# EAGLE schematic esp-n64 (EAGLE 9.6.2)
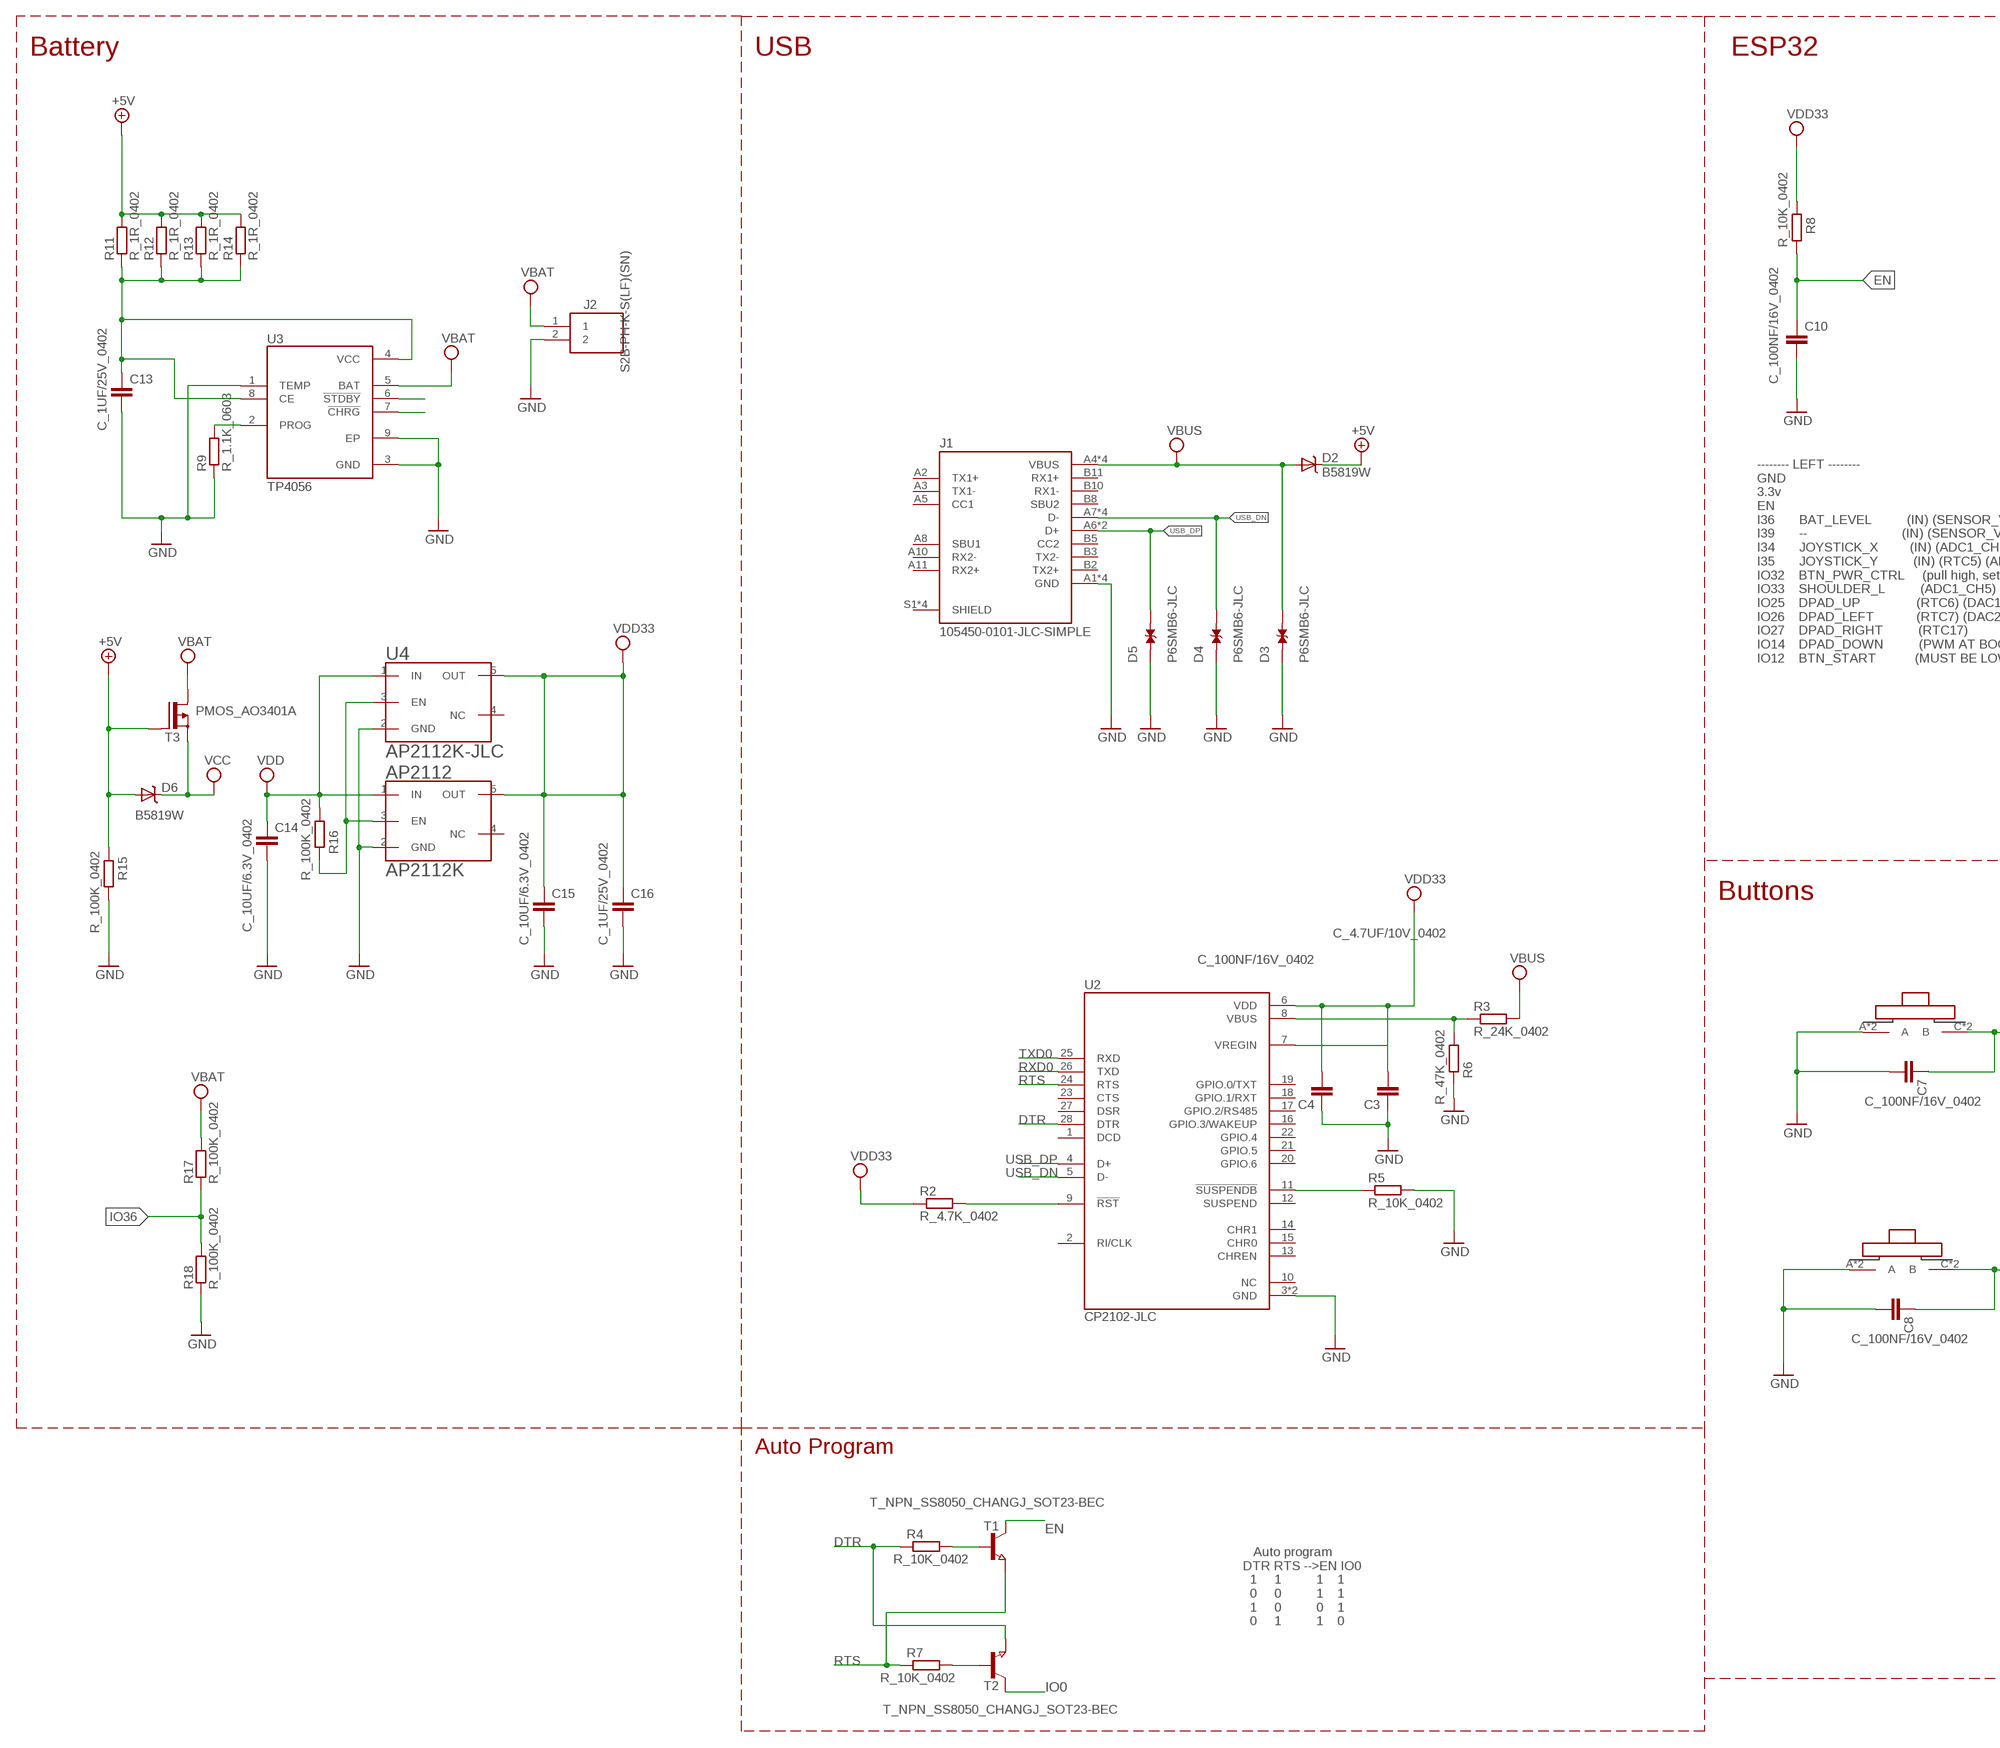
[diagram p0: schematic, sheet 1, part 1 of 2]
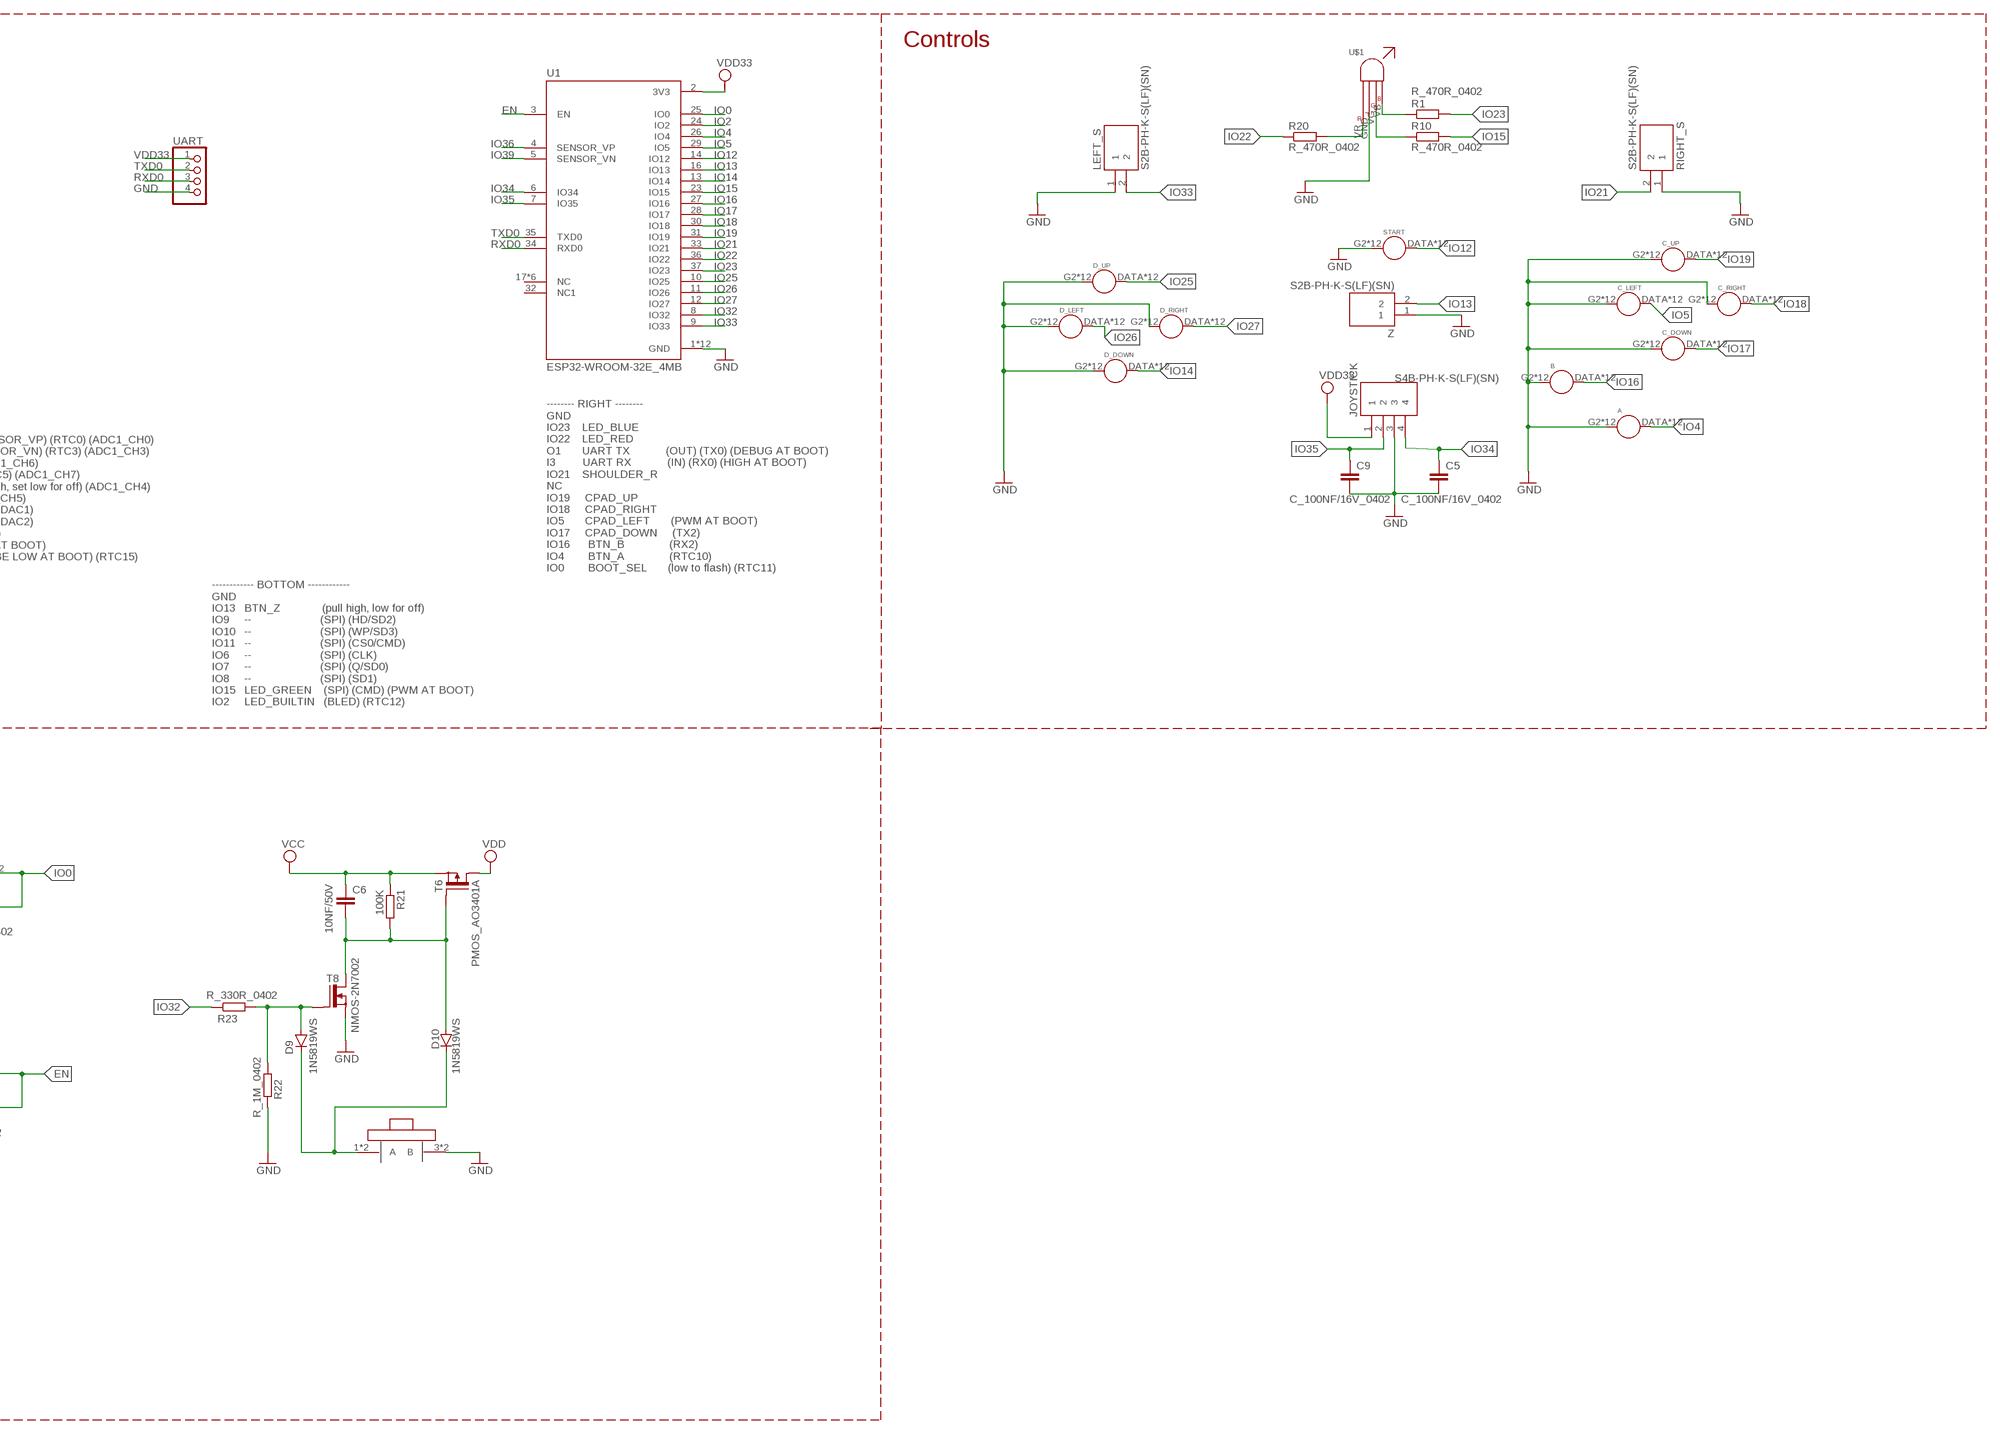
[diagram p1: schematic, sheet 1, part 2 of 2]

## Parts
A  BUTTONPCB-CONDUCTIVE  [BUTTON-PAD]
AP2112  AP2112K  [SOT-23-5]
B  BUTTONPCB-CONDUCTIVE  [BUTTON-PAD]
BOOT  TS1187-SIMPLE  [TS1187]
C3  C_4.7UF/10V_0402  [C0402]
C4  C_100NF/16V_0402  [C0402]
C5  C_100NF/16V_0402  [C0402]
C6  10NF/50V  C_10NF/50V_0402  [C0402]
C7  C_100NF/16V_0402  [C0402]
C8  C_100NF/16V_0402  [C0402]
C9  C_100NF/16V_0402  [C0402]
C10  C_100NF/16V_0402  [C0402]
C13  C_1UF/25V_0402  [C0402]
C14  C_10UF/6.3V_0402  [C0402]
C15  C_10UF/6.3V_0402  [C0402]
C16  C_1UF/25V_0402  [C0402]
C_DOWN  BUTTONPCB-CONDUCTIVE  [BUTTON-PAD]
C_LEFT  BUTTONPCB-CONDUCTIVE  [BUTTON-PAD]
C_RIGHT  BUTTONPCB-CONDUCTIVE  [BUTTON-PAD]
C_UP  BUTTONPCB-CONDUCTIVE  [BUTTON-PAD]
CTRL  FSM14J-SIMPLE  [SW_FSM14J]
D2  B5819W  [SOD-123]
D3  P6SMB6-JLC  [P6SMB6]
D4  P6SMB6-JLC  [P6SMB6]
D5  P6SMB6-JLC  [P6SMB6]
D6  B5819W  [SOD-123]
D9  1N5819WS  D_1N5819WS_GUANGH_SOD323  [SOD323]
D10  1N5819WS  D_1N5819WS_GUANGH_SOD323  [SOD323]
D_DOWN  BUTTONPCB-CONDUCTIVE  [BUTTON-PAD]
D_LEFT  BUTTONPCB-CONDUCTIVE  [BUTTON-PAD]
D_RIGHT  BUTTONPCB-CONDUCTIVE  [BUTTON-PAD]
D_UP  D_UP  BUTTONPCB-CONDUCTIVE  [BUTTON-PAD]
J1  105450-0101-JLC-SIMPLE  [MOLEX_105450-0101-SIMPLE]
J2  S2B-PH-K-S(LF)(SN)  [JST_S2B-PH-K-S(LF)(SN)]
JOYSTICK  S4B-PH-K-S(LF)(SN)  [JST_S4B-PH-K-S(LF)(SN)]
LEFT_S  S2B-PH-K-S(LF)(SN)  [JST_S2B-PH-K-S(LF)(SN)]
R1  R_470R_0402  [R0402]
R2  R_4.7K_0402  [R0402]
R3  R_24K_0402  [R0402]
R4  R_10K_0402  [R0402]
R5  R_10K_0402  [R0402]
R6  R_47K_0402  [R0402]
R7  R_10K_0402  [R0402]
R8  R_10K_0402  [R0402]
R9  R_1.1K_0603  [R0603]
R10  R_470R_0402  [R0402]
R11  R_1R_0402  [R0402]
R12  R_1R_0402  [R0402]
R13  R_1R_0402  [R0402]
R14  R_1R_0402  [R0402]
R15  R_100K_0402  [R0402]
R16  R_100K_0402  [R0402]
R17  R_100K_0402  [R0402]
R18  R_100K_0402  [R0402]
R20  R_470R_0402  [R0402]
R21  100K  R_100K_0402  [R0402]
R22  R_1M_0402  [R0402]
R23  R_330R_0402  [R0402]
RESET  TS1187-SIMPLE  [TS1187]
RIGHT_S  S2B-PH-K-S(LF)(SN)  [JST_S2B-PH-K-S(LF)(SN)]
START  BUTTONPCB-CONDUCTIVE  [BUTTON-PAD]
T1  T_NPN_SS8050_CHANGJ_SOT23-BEC  [SOT23]
T2  T_NPN_SS8050_CHANGJ_SOT23-BEC  [SOT23]
T3  PMOS_AO3401A  T_P-MOSFET_AO3401A_ALPHA_SOT23-GSD  [SOT23]
T6  PMOS_AO3401A  T_P-MOSFET_AO3401A_ALPHA_SOT23-GSD  [SOT23]
T8  NMOS-2N7002  T_N-MOSFET_2N7002_CHANGJ_SOT23-GSD  [SOT23]
U1  ESP32-WROOM-32E_4MB  [ESP32-WROOM-32E]
U2  CP2102-JLC  [QFN50P500X500X80-29N]
U3  TP4056  [SOP127P600X175-9N]
U4  AP2112K-JLC  [SOT-23-5]
U$1  RGB-LED  [1X04-LED-RGB]
UART  PINHD-1X4  [1X04]
Z  S2B-PH-K-S(LF)(SN)  [JST_S2B-PH-K-S(LF)(SN)]

## Nets
+5V: D2.C D6.A R11.2 R12.2 R13.2 R14.2 R15.2 T3.1(G)
DTR: R4.1 T2.2(E) U2.28(DTR)
EN: C8.1 C10.1 R8.1 RESET.C(B) RESET.D(B) T1.3(C) U1.3(EN)
GND: A.G2(GND) A.G3(GND) A.G4(GND) A.G5(GND) A.G6(GND) A.G7(GND) A.G8(GND) A.G9(GND) A.G10(GND) A.G11(GND) A.G12(GND) A.GND AP2112.2(GND) B.G2(GND) B.G3(GND) B.G4(GND) B.G5(GND) B.G6(GND) B.G7(GND) B.G8(GND) B.G9(GND) B.G10(GND) B.G11(GND) B.G12(GND) B.GND BOOT.A BOOT.B(A) C3.1 C4.1 C5.2 C7.2 C8.2 C9.2 C10.2 C13.2 C14.2 C15.2 C16.2 C_DOWN.G2(GND) C_DOWN.G3(GND) C_DOWN.G4(GND) C_DOWN.G5(GND) C_DOWN.G6(GND) C_DOWN.G7(GND) C_DOWN.G8(GND) C_DOWN.G9(GND) C_DOWN.G10(GND) C_DOWN.G11(GND) C_DOWN.G12(GND) C_DOWN.GND C_LEFT.G2(GND) C_LEFT.G3(GND) C_LEFT.G4(GND) C_LEFT.G5(GND) C_LEFT.G6(GND) C_LEFT.G7(GND) C_LEFT.G8(GND) C_LEFT.G9(GND) C_LEFT.G10(GND) C_LEFT.G11(GND) C_LEFT.G12(GND) C_LEFT.GND C_RIGHT.G2(GND) C_RIGHT.G3(GND) C_RIGHT.G4(GND) C_RIGHT.G5(GND) C_RIGHT.G6(GND) C_RIGHT.G7(GND) C_RIGHT.G8(GND) C_RIGHT.G9(GND) C_RIGHT.G10(GND) C_RIGHT.G11(GND) C_RIGHT.G12(GND) C_RIGHT.GND C_UP.G2(GND) C_UP.G3(GND) C_UP.G4(GND) C_UP.G5(GND) C_UP.G6(GND) C_UP.G7(GND) C_UP.G8(GND) C_UP.G9(GND) C_UP.G10(GND) C_UP.G11(GND) C_UP.G12(GND) C_UP.GND CTRL.3(B) CTRL.4(B) D3.1 D4.1 D5.1 D_DOWN.G2(GND) D_DOWN.G3(GND) D_DOWN.G4(GND) D_DOWN.G5(GND) D_DOWN.G6(GND) D_DOWN.G7(GND) D_DOWN.G8(GND) D_DOWN.G9(GND) D_DOWN.G10(GND) D_DOWN.G11(GND) D_DOWN.G12(GND) D_DOWN.GND D_LEFT.G2(GND) D_LEFT.G3(GND) D_LEFT.G4(GND) D_LEFT.G5(GND) D_LEFT.G6(GND) D_LEFT.G7(GND) D_LEFT.G8(GND) D_LEFT.G9(GND) D_LEFT.G10(GND) D_LEFT.G11(GND) D_LEFT.G12(GND) D_LEFT.GND D_RIGHT.G2(GND) D_RIGHT.G3(GND) D_RIGHT.G4(GND) D_RIGHT.G5(GND) D_RIGHT.G6(GND) D_RIGHT.G7(GND) D_RIGHT.G8(GND) D_RIGHT.G9(GND) D_RIGHT.G10(GND) D_RIGHT.G11(GND) D_RIGHT.G12(GND) D_RIGHT.GND D_UP.G2(GND) D_UP.G3(GND) D_UP.G4(GND) D_UP.G5(GND) D_UP.G6(GND) D_UP.G7(GND) D_UP.G8(GND) D_UP.G9(GND) D_UP.G10(GND) D_UP.G11(GND) D_UP.G12(GND) D_UP.GND J1.A1(GND) J1.A12(GND) J1.B1(GND) J1.B12(GND) J2.2 JOYSTICK.3 LEFT_S.1 R5.2 R6.1 R9.1 R15.1 R18.1 R22.2 RESET.A RESET.B(A) RIGHT_S.1 START.G2(GND) START.G3(GND) START.G4(GND) START.G5(GND) START.G6(GND) START.G7(GND) START.G8(GND) START.G9(GND) START.G10(GND) START.G11(GND) START.G12(GND) START.GND T8.2(S) U1.1(GND) U1.15(GND) U1.38(GND) U1.39_1(GND) U1.39_2(GND) U1.39_3(GND) U1.39_4(GND) U1.39_5(GND) U1.39_6(GND) U1.39_7(GND) U1.39_8(GND) U1.39_9(GND) U2.3(GND) U2.29(GND) U3.1(TEMP) U3.3(GND) U3.9(EP) U4.2(GND) U$1.GND UART.4 Z.1
IO0: BOOT.C(B) BOOT.D(B) C7.1 T2.3(C) U1.25(IO0)
IO2: U1.24(IO2)
IO4: A.DATA2(D) A.DATA3(D) A.DATA4(D) A.DATA5(D) A.DATA6(D) A.DATA7(D) A.DATA8(D) A.DATA9(D) A.DATA10(D) A.DATA11(D) A.DATA12(D) A.DATA(D) U1.26(IO4)
IO5: C_LEFT.DATA2(D) C_LEFT.DATA3(D) C_LEFT.DATA4(D) C_LEFT.DATA5(D) C_LEFT.DATA6(D) C_LEFT.DATA7(D) C_LEFT.DATA8(D) C_LEFT.DATA9(D) C_LEFT.DATA10(D) C_LEFT.DATA11(D) C_LEFT.DATA12(D) C_LEFT.DATA(D) U1.29(IO5)
IO12: START.DATA2(D) START.DATA3(D) START.DATA4(D) START.DATA5(D) START.DATA6(D) START.DATA7(D) START.DATA8(D) START.DATA9(D) START.DATA10(D) START.DATA11(D) START.DATA12(D) START.DATA(D) U1.14(IO12)
IO13: U1.16(IO13) Z.2
IO14: D_DOWN.DATA2(D) D_DOWN.DATA3(D) D_DOWN.DATA4(D) D_DOWN.DATA5(D) D_DOWN.DATA6(D) D_DOWN.DATA7(D) D_DOWN.DATA8(D) D_DOWN.DATA9(D) D_DOWN.DATA10(D) D_DOWN.DATA11(D) D_DOWN.DATA12(D) D_DOWN.DATA(D) U1.13(IO14)
IO15: R10.2 U1.23(IO15)
IO16: B.DATA2(D) B.DATA3(D) B.DATA4(D) B.DATA5(D) B.DATA6(D) B.DATA7(D) B.DATA8(D) B.DATA9(D) B.DATA10(D) B.DATA11(D) B.DATA12(D) B.DATA(D) U1.27(IO16)
IO17: C_DOWN.DATA2(D) C_DOWN.DATA3(D) C_DOWN.DATA4(D) C_DOWN.DATA5(D) C_DOWN.DATA6(D) C_DOWN.DATA7(D) C_DOWN.DATA8(D) C_DOWN.DATA9(D) C_DOWN.DATA10(D) C_DOWN.DATA11(D) C_DOWN.DATA12(D) C_DOWN.DATA(D) U1.28(IO17)
IO18: C_RIGHT.DATA2(D) C_RIGHT.DATA3(D) C_RIGHT.DATA4(D) C_RIGHT.DATA5(D) C_RIGHT.DATA6(D) C_RIGHT.DATA7(D) C_RIGHT.DATA8(D) C_RIGHT.DATA9(D) C_RIGHT.DATA10(D) C_RIGHT.DATA11(D) C_RIGHT.DATA12(D) C_RIGHT.DATA(D) U1.30(IO18)
IO19: C_UP.DATA2(D) C_UP.DATA3(D) C_UP.DATA4(D) C_UP.DATA5(D) C_UP.DATA6(D) C_UP.DATA7(D) C_UP.DATA8(D) C_UP.DATA9(D) C_UP.DATA10(D) C_UP.DATA11(D) C_UP.DATA12(D) C_UP.DATA(D) U1.31(IO19)
IO21: RIGHT_S.2 U1.33(IO21)
IO22: R20.1 U1.36(IO22)
IO23: R1.2 U1.37(IO23)
IO25: D_UP.DATA2(D) D_UP.DATA3(D) D_UP.DATA4(D) D_UP.DATA5(D) D_UP.DATA6(D) D_UP.DATA7(D) D_UP.DATA8(D) D_UP.DATA9(D) D_UP.DATA10(D) D_UP.DATA11(D) D_UP.DATA12(D) D_UP.DATA(D) U1.10(IO25)
IO26: D_LEFT.DATA2(D) D_LEFT.DATA3(D) D_LEFT.DATA4(D) D_LEFT.DATA5(D) D_LEFT.DATA6(D) D_LEFT.DATA7(D) D_LEFT.DATA8(D) D_LEFT.DATA9(D) D_LEFT.DATA10(D) D_LEFT.DATA11(D) D_LEFT.DATA12(D) D_LEFT.DATA(D) U1.11(IO26)
IO27: D_RIGHT.DATA2(D) D_RIGHT.DATA3(D) D_RIGHT.DATA4(D) D_RIGHT.DATA5(D) D_RIGHT.DATA6(D) D_RIGHT.DATA7(D) D_RIGHT.DATA8(D) D_RIGHT.DATA9(D) D_RIGHT.DATA10(D) D_RIGHT.DATA11(D) D_RIGHT.DATA12(D) D_RIGHT.DATA(D) U1.12(IO27)
IO32: R23.1 U1.8(IO32)
IO33: LEFT_S.2 U1.9(IO33)
IO34: C5.1 JOYSTICK.4 U1.6(IO34)
IO35: C9.1 JOYSTICK.2 U1.7(IO35)
IO36: R17.1 R18.2 U1.4(SENSOR_VP)
IO39: U1.5(SENSOR_VN)
N$1: R20.2 U$1.VR
N$2: AP2112.3(EN) R16.1 U4.3(EN)
N$4: D9.A R22.1 R23.2 T8.1(G)
N$5: R10.1 U$1.VG
N$6: R4.2 T1.1(B)
N$7: R7.2 T2.1(B)
N$8: C13.1 R11.1 R12.1 R13.1 R14.1 U3.4(VCC) U3.8(CE)
N$9: R1.1 U$1.VB
N$11: R2.2 U2.9(!RST)
N$12: U3.6(!STDBY)
N$14: R3.1 R6.2 U2.8(VBUS)
N$15: C6.2 D10.A R21.2 T6.1(G) T8.3(D)
N$16: U3.7(!CHRG)
N$17: R9.2 U3.2(PROG)
N$23: R5.1 U2.11(!SUSPENDB)
N$28: CTRL.1(A) CTRL.2(A) D9.C D10.C
RTS: R7.1 T1.2(E) U2.24(RTS)
RXD0: U1.34(RXD0) U2.26(TXD) UART.3
TXD0: U1.35(TXD0) U2.25(RXD) UART.2
USB_DN: D4.2 J1.A7(D-) J1.B7(D-) J1.P$1(D-) J1.P$2(D-) U2.5(D-)
USB_DP: D5.2 J1.A6(D+) J1.B6(D+) U2.4(D+)
VBAT: J2.1 R17.2 T3.3(D) U3.5(BAT)
VBUS: D2.A D3.2 J1.A4(VBUS) J1.A9(VBUS) J1.B4(VBUS) J1.B9(VBUS) R3.2
VCC: C6.1 D6.C R21.1 T3.2(S) T6.2(S)
VDD: AP2112.1(IN) C14.1 R16.2 T6.3(D) U4.1(IN)
VDD33: AP2112.5(OUT) C3.2 C4.2 C15.1 C16.1 JOYSTICK.1 R2.1 R8.2 U1.2(3V3) U2.6(VDD) U2.7(VREGIN) U4.5(OUT) UART.1
Unconnected: AP2112.4(NC) J1.A2(TX1+) J1.A3(TX1-) J1.A5(CC1) J1.A8(SBU1) J1.A10(RX2-) J1.A11(RX2+) J1.B2(TX2+) J1.B3(TX2-) J1.B5(CC2) J1.B8(SBU2) J1.B10(RX1-) J1.B11(RX1+) J1.S1(SHIELD) J1.S2(SHIELD) J1.S3(SHIELD) J1.S4(SHIELD) U1.17(NC) U1.18(NC) U1.19(NC) U1.20(NC) U1.21(NC) U1.22(NC) U1.32(NC1) U2.1(DCD) U2.2(RI/CLK) U2.10(NC) U2.12(SUSPEND) U2.13(CHREN) U2.14(CHR1) U2.15(CHR0) U2.16(GPIO.3/WAKEUP) U2.17(GPIO.2/RS485) U2.18(GPIO.1/RXT) U2.19(GPIO.0/TXT) U2.20(GPIO.6) U2.21(GPIO.5) U2.22(GPIO.4) U2.23(CTS) U2.27(DSR) U4.4(NC)

## Notes on the sheet
- Battery | USB | ESP32 | Controls
- -------- LEFT --------
  GND
  3.3v
  EN
  I36       BAT_LEVEL          (IN) (SENSOR_VP) (RTC0) (ADC1_CH0)
  I39       --                           (IN) (SENSOR_VN) (RTC3) (ADC1_CH3)
  I34       JOYSTICK_X         (IN) (ADC1_CH6)
  I35       JOYSTICK_Y          (IN) (RTC5) (ADC1_CH7)
  IO32    BTN_PWR_CTRL     (pull high, set low for off) (ADC1_CH4)
  IO33    SHOULDER_L          (ADC1_CH5)
  IO25    DPAD_UP                (RTC6) (DAC1) 
  IO26    DPAD_LEFT            (RTC7) (DAC2) 
  IO27    DPAD_RIGHT          (RTC17)
  IO14    DPAD_DOWN          (PWM AT BOOT)
  IO12    BTN_START           (MUST BE LOW AT BOOT) (RTC15)
- -------- RIGHT --------
  GND
  IO23    LED_BLUE
  IO22    LED_RED
  O1       UART TX            (OUT) (TX0) (DEBUG AT BOOT)
  I3         UART RX            (IN) (RX0) (HIGH AT BOOT)
  IO21    SHOULDER_R
  NC
  IO19     CPAD_UP
  IO18     CPAD_RIGHT
  IO5       CPAD_LEFT       (PWM AT BOOT)
  IO17     CPAD_DOWN     (TX2)
  IO16      BTN_B               (RX2)
  IO4        BTN_A               (RTC10)
  IO0        BOOT_SEL       (low to flash) (RTC11)
- ------------ BOTTOM ------------
  GND
  IO13   BTN_Z              (pull high, low for off)
  IO9     --                       (SPI) (HD/SD2)
  IO10   --                       (SPI) (WP/SD3)
  IO11   --                       (SPI) (CS0/CMD)
  IO6     --                       (SPI) (CLK)
  IO7     --                       (SPI) (Q/SD0)
  IO8     --                       (SPI) (SD1)
  IO15   LED_GREEN    (SPI) (CMD) (PWM AT BOOT)
  IO2     LED_BUILTIN   (BLED) (RTC12)
- Buttons
- Auto Program
- Auto program 
  DTR RTS -->EN IO0 
    1     1          1    1 
    0     0          1    1 
    1     0          0    1 
    0     1          1    0

## Library data of the parts
A B C_DOWN C_LEFT C_RIGHT C_UP D_DOWN D_LEFT D_RIGHT D_UP START = controller-inputs:BUTTON
AP2112 = AP2112:AP2112K: Sot223/Pkg 1-Amp 5-Volt Low Drop Out Voltage Regulatator Check availability <https://pricing.snapeda.com/parts/AMS1117/Advanced%20Monolithic%20Systems/view-part?ref=eda>
BOOT RESET = tactileswitch-ts1187:TS1187-SIMPLE; LCSC_PART: C318884
C3 = JLC PCB Basic Parts_loc:C_: Capacitor General purpose SMD Capacitor; LCSC_DATASHEET: https://datasheet.lcsc.com/lcsc/1810191211_Samsung-Electro-Mechanics-CL05A475MP5NRNC_C23733.pdf; LCSC_PART: C23733; LCSC_ROTATION_CCW: 0; LCSC_STOCK: 424928; PROPERTIES: 10V 4.7uF X5R ±20% 0402 ROHS
C4 C5 C7-C10 = JLC PCB Basic Parts_loc:C_: Capacitor General purpose SMD Capacitor; LCSC_DATASHEET: https://datasheet.lcsc.com/lcsc/1810191219_Samsung-Electro-Mechanics-CL05B104KO5NNNC_C1525.pdf; LCSC_PART: C1525; LCSC_ROTATION_CCW: 0; LCSC_STOCK: 7852677; PROPERTIES: 16V 100nF X7R ±10% 0402 ROHS
C6 = JLC PCB Basic Parts_loc:C_: Capacitor General purpose SMD Capacitor; LCSC_DATASHEET: https://datasheet.lcsc.com/lcsc/1810191223_Samsung-Electro-Mechanics-CL05B103KB5NNNC_C15195.pdf; LCSC_PART: C15195; LCSC_ROTATION_CCW: 0; LCSC_STOCK: 7659158; PROPERTIES: 50V 10nF X7R ±10% 0402 ROHS
C13 C16 = JLC PCB Basic Parts_loc:C_: Capacitor General purpose SMD Capacitor; LCSC_DATASHEET: https://datasheet.lcsc.com/lcsc/1811091611_Samsung-Electro-Mechanics-CL05A105KA5NQNC_C52923.pdf; LCSC_PART: C52923; LCSC_ROTATION_CCW: 0; LCSC_STOCK: 6404174; PROPERTIES: 25V 1uF X5R ±10% 0402 ROHS
C14 C15 = JLC PCB Basic Parts_loc:C_: Capacitor General purpose SMD Capacitor; LCSC_DATASHEET: https://datasheet.lcsc.com/lcsc/1810191215_Samsung-Electro-Mechanics-CL05A106MQ5NUNC_C15525.pdf; LCSC_PART: C15525; LCSC_ROTATION_CCW: 0; LCSC_STOCK: 1727946; PROPERTIES: 6.3V 10uF X5R ±20% 0402 ROHS
CTRL = tactileswitch-FSM14J:FSM14J-SIMPLE
D2 D6 = B5819W:B5819W: Diode. LCSC C8598 Check availability <https://pricing.snapeda.com/parts/B5819W/MDD/view-part?ref=eda>; AVAILABILITY: In Stock; DESCRIPTION: Diode Schottky 40 V 1.5A Surface Mount SOD-123FL; LCSC_PART: C8598; MF: MDD; MP: B5819W; PACKAGE: None; PRICE: None; PURCHASE-URL: https://pricing.snapeda.com/search/part/B5819W/?ref=eda
D3-D5 = 5v-bidir-protection-P6SMB6:P6SMB6-JLC: Check availability <https://pricing.snapeda.com/parts/LESD5D5.0CT1G/Leshan%20Radio%20Co./view-part?ref=eda>; AVAILABILITY: Not in stock; DESCRIPTION: Transient Voltage Suppressors for ESD Protection; LCSC_PART: C78395; MF: Brightking Elec (TAIWAN); MP: P6SMB6.8CA; PACKAGE: SMB-DO-214AA-0; PRICE: 0.0509
D9 D10 = JLC PCB Basic Parts_loc:D_: Diode; LCSC_DATASHEET: https://datasheet.lcsc.com/lcsc/2204281430_Guangdong-Hottech-1N5819WS_C191023.pdf; LCSC_PART: C191023; PROPERTIES: 40V 600mV@1A 1A SOD-323 Schottky Barrier Diodes (SBD) ROHS
J1 = usbc-molex-105450-0101:105450-0101-JLC-SIMPLE: Check availability <https://pricing.snapeda.com/parts/1054500101/Molex/view-part?ref=eda>; AVAILABILITY: In Stock; DESCRIPTION: USB-C (USB TYPE-C) USB 3.2 Gen 2 (USB 3.1 Gen 2, Superspeed + (USB 3.1)) Receptacle Connector 24 Position Surface Mount, Right Angle; Through Hole; LCSC_PART: C134092; MF: Molex; MP: 1054500101; PACKAGE: None; PRICE: None; PURCHASE-URL: https://pricing.snapeda.com/search/part/1054500101/?ref=eda
J2 LEFT_S RIGHT_S Z = jst-2pin-90:S2B-PH-K-S(LF)(SN): PH Series 2 Position 2.0 mm Through Hole Side Entry Shrouded Header Check availability <https://pricing.snapeda.com/parts/S2B-PH-K-S%28LF%29%28SN%29/JST%20Sales%20America%20Inc./view-part?ref=eda>; AVAILABILITY: In Stock; DESCRIPTION: Connector Header Through Hole, Right Angle 2 position; MF: JST Sales America Inc.; MP: S2B-PH-K-S(LF)(SN); PACKAGE: None; PRICE: None; PURCHASE-URL: https://pricing.snapeda.com/search/part/S2B-PH-K-S(LF)(SN)/?ref=eda
JOYSTICK = jst-4pin-90:S4B-PH-K-S(LF)(SN): PH Series 4 Position 2 mm Pitch Through Hole Side Entry Shrouded Header Check availability <https://pricing.snapeda.com/parts/S4B-PH-K-S%28LF%29%28SN%29/JST%20Sales/view-part?ref=eda>; AVAILABILITY: In Stock; DESCRIPTION: Connector Header Through Hole, Right Angle 4 position 0.079 (2.00mm); MF: JST Sales; MP: S4B-PH-K-S(LF)(SN); PACKAGE: None; PRICE: None; PURCHASE-URL: https://pricing.snapeda.com/search/part/S4B-PH-K-S(LF)(SN)/?ref=eda
R1 R10 R20 = JLC PCB Basic Parts_loc:R_: Resistor General purpose SMD Resistor; LCSC_DATASHEET: https://datasheet.lcsc.com/lcsc/2110252230_UNI-ROYAL-Uniroyal-Elec-0402WGF4700TCE_C25117.pdf; LCSC_PART: C25117; LCSC_ROTATION_CCW: 0; LCSC_STOCK: 83930; PROPERTIES: ±1% 1/16W Thick Film Resistors 50V ±100ppm -55°C~+155°C 470Ohm 0402 ROHS
R2 = JLC PCB Basic Parts_loc:R_: Resistor General purpose SMD Resistor; LCSC_DATASHEET: https://datasheet.lcsc.com/lcsc/2110260030_UNI-ROYAL-Uniroyal-Elec-0402WGF4701TCE_C25900.pdf; LCSC_PART: C25900; LCSC_ROTATION_CCW: 0; LCSC_STOCK: 2784412; PROPERTIES: ±1% 1/16W Thick Film Resistors 50V ±100ppm -55°C~+155°C 4.7kOhm 0402 ROHS
R3 = JLC PCB Basic Parts_loc:R_: Resistor General purpose SMD Resistor; LCSC_DATASHEET: https://datasheet.lcsc.com/lcsc/2110260030_UNI-ROYAL-Uniroyal-Elec-0402WGF2402TCE_C25769.pdf; LCSC_PART: C25769; LCSC_ROTATION_CCW: 0; LCSC_STOCK: 100393; PROPERTIES: ±1% 1/16W Thick Film Resistors 50V ±100ppm -55°C~+155°C 24kOhm 0402 ROHS
R4 R5 R7 R8 = JLC PCB Basic Parts_loc:R_: Resistor General purpose SMD Resistor; LCSC_DATASHEET: https://datasheet.lcsc.com/lcsc/2110260030_UNI-ROYAL-Uniroyal-Elec-0402WGF1002TCE_C25744.pdf; LCSC_PART: C25744; LCSC_ROTATION_CCW: 0; LCSC_STOCK: 11564817; PROPERTIES: ±1% 1/16W Thick Film Resistors 50V ±100ppm -55°C~+155°C 10kOhm 0402 ROHS
R6 = JLC PCB Basic Parts_loc:R_: Resistor General purpose SMD Resistor; LCSC_DATASHEET: https://datasheet.lcsc.com/lcsc/2110260030_UNI-ROYAL-Uniroyal-Elec-0402WGF4702TCE_C25792.pdf; LCSC_PART: C25792; LCSC_ROTATION_CCW: 0; LCSC_STOCK: 1322764; PROPERTIES: ±1% 1/16W Thick Film Resistors 50V ±100ppm -55°C~+155°C 47kOhm 0402 ROHS
R9 = JLC PCB Basic Parts_loc:R_: Resistor General purpose SMD Resistor; LCSC_DATASHEET: https://datasheet.lcsc.com/lcsc/2110252030_UNI-ROYAL-Uniroyal-Elec-0603WAF1101T5E_C22764.pdf; LCSC_PART: C22764; LCSC_ROTATION_CCW: 0; LCSC_STOCK: 123057; PROPERTIES: ±1% 1/10W Thick Film Resistors 75V ±100ppm -55°C~+155°C 1.1kOhm 0603 ROHS
R11-R14 = JLC PCB Basic Parts_loc:R_: Resistor General purpose SMD Resistor; LCSC_DATASHEET: https://datasheet.lcsc.com/lcsc/2110252230_UNI-ROYAL-Uniroyal-Elec-0402WGF100KTCE_C25086.pdf; LCSC_PART: C25086; LCSC_ROTATION_CCW: 0; LCSC_STOCK: 22037; PROPERTIES: ±1% 1/16W Thick Film Resistors 50V ±200ppm -55°C~+155°C 1Ohm 0402 ROHS
R15-R18 R21 = JLC PCB Basic Parts_loc:R_: Resistor General purpose SMD Resistor; LCSC_DATASHEET: https://datasheet.lcsc.com/lcsc/2110260030_UNI-ROYAL-Uniroyal-Elec-0402WGF1003TCE_C25741.pdf; LCSC_PART: C25741; LCSC_ROTATION_CCW: 0; LCSC_STOCK: 423883; PROPERTIES: ±1% 1/16W Thick Film Resistors 50V ±100ppm -55°C~+155°C 100kOhm 0402 ROHS
R22 = JLC PCB Basic Parts_loc:R_: Resistor General purpose SMD Resistor; LCSC_DATASHEET: https://datasheet.lcsc.com/lcsc/2110260130_UNI-ROYAL-Uniroyal-Elec-0402WGF1004TCE_C26083.pdf; LCSC_PART: C26083; LCSC_ROTATION_CCW: 0; LCSC_STOCK: 1171974; PROPERTIES: ±1% 1/16W Thick Film Resistors 50V ±100ppm -55°C~+155°C 1MOhm 0402 ROHS
R23 = JLC PCB Basic Parts_loc:R_: Resistor General purpose SMD Resistor; LCSC_DATASHEET: https://datasheet.lcsc.com/lcsc/2110252230_UNI-ROYAL-Uniroyal-Elec-0402WGF3300TCE_C25104.pdf; LCSC_PART: C25104; LCSC_ROTATION_CCW: 0; LCSC_STOCK: 431435; PROPERTIES: ±1% 1/16W Thick Film Resistors 50V ±100ppm -55°C~+155°C 330Ohm 0402 ROHS
T1 T2 = JLC PCB Basic Parts_loc:T_NPN_: Transistor NPN; LCSC_DATASHEET: https://datasheet.lcsc.com/lcsc/1811052004_Changjiang-Electronics-Tech--CJ-SS8050_C2150.pdf; LCSC_PART: C2150; LCSC_ROTATION: 180; LCSC_STOCK: 1125240; PROPERTIES: 25V 300mW 1.5A 200@100mA,1V 100MHz 500mV@800mA,80mA NPN +150°C@(Tj) SOT-23(SOT-23-3) Bipolar Transistors - BJT ROHS
T3 T6 = JLC PCB Basic Parts_loc:T_P-MOSFET_: Transistor P-MOSFET; LCSC_DATASHEET: https://datasheet.lcsc.com/lcsc/1810171817_Alpha---Omega-Semicon-AO3401A_C15127.pdf; LCSC_PART: C15127; LCSC_ROTATION: 180; LCSC_STOCK: 67241; PROPERTIES: 30V 4A 44mOhm@10V,4.3A 1.4W 1.3V@250A P Channel SOT-23-3L MOSFETs ROHS
T8 = JLC PCB Basic Parts_loc:T_N-MOSFET_: Transistor N-MOSFET; LCSC_DATASHEET: https://datasheet.lcsc.com/lcsc/1810151612_Changjiang-Electronics-Tech--CJ-2N7002_C8545.pdf; LCSC_PART: C8545; LCSC_ROTATION: 180; LCSC_STOCK: 801941; PROPERTIES: 60V 115mA 200mW 7.5Ohm@10V,500mA 2.5V@250A N Channel SOT-23(SOT-23-3) MOSFETs ROHS
U1 = ESP32-WROOM-32E:ESP32-WROOM-32E: Check availability <https://pricing.snapeda.com/parts/ESP32-WROOM-32E%20%284MB%20HIGH%20TEMP%29/Espressif%20Systems/view-part?ref=eda>; DATASHEET: https://www.espressif.com/sites/default/files/documentation/esp32-wroom-32e_esp32-wroom-32ue_datasheet_en.pdf; DESCRIPTION: Bluetooth, WiFi 802.11b/g/n, Bluetooth v4.2 +EDR, Class 1, 2 and 3 Transceiver Module 2.4GHz ~ 2.5GHz Integrated, Trace Surface Mount; JLC_ROTATION: 90; LCSC_PART: C701341; LCSC_PRICE: 3.108; LCSC_STOCK: 5765; MF: Espressif Systems; MP: ESP32-WROOM-32E; PACKAGE: SMD-44 Espressif Systems
U2 = usbtouart-CP2102:CP2102-JLC: USB Bridge, USB to UART USB 2.0 UART Interface 28-QFN (5x5) Check availability <https://pricing.snapeda.com/parts/CP2102N-A01-GQFN28/Silicon%20Labs/view-part?ref=eda>; AVAILABILITY: In Stock; DESCRIPTION: USB Bridge, USB to UART USB 2.0 UART Interface 28-QFN (5x5); LCSC_PART: C6568; LCSC_ROTATION: 90; MF: Silicon Labs; MP: CP2102-GMR; PACKAGE: QFN-28_EP_5.0x5.0x0.5P; PRICE: None; PURCHASE-URL: https://pricing.snapeda.com/search/part/CP2102N-A01-GQFN28/?ref=eda
U3 = TP4056:TP4056: Complete single cell Li-Ion battery with a constant current / constant voltage linear charger Check availability <https://pricing.snapeda.com/parts/TP4056/NanJing%20Top%20Power%20ASIC%20Corp./view-part?ref=eda>; AVAILABILITY: Not in stock; DESCRIPTION: Complete single cell Li-Ion battery with a constant current / constant voltage linear charger; JLC_ROTATION: 270; LCSC_PART: C16581; LCSC_PRICE: 0.2193; LCSC_STOCK: 34744; MF: NanJing Top Power ASIC Corp.; MP: TP4056; PACKAGE: None; PRICE: None
U4 = AP2112:AP2112K-JLC: Sot223/Pkg 1-Amp 5-Volt Low Drop Out Voltage Regulatator Check availability <https://pricing.snapeda.com/parts/AMS1117/Advanced%20Monolithic%20Systems/view-part?ref=eda>; LCSC_PART: C51118; LCSC_PRICE: 0.903; LCSC_ROTATION: 270; LCSC_STOCK: 2912
U$1 = controller-inputs:RGB-LED
UART = pinhead:PINHD-1X4: PIN HEADER